# EasyEDA schematic curtains_stepper.json
TITLE: Sheet_1; REV: 1.0; Date: 2023-05-25; Sheet: 1/1; Drawn By: bowes372; Company: Your Company
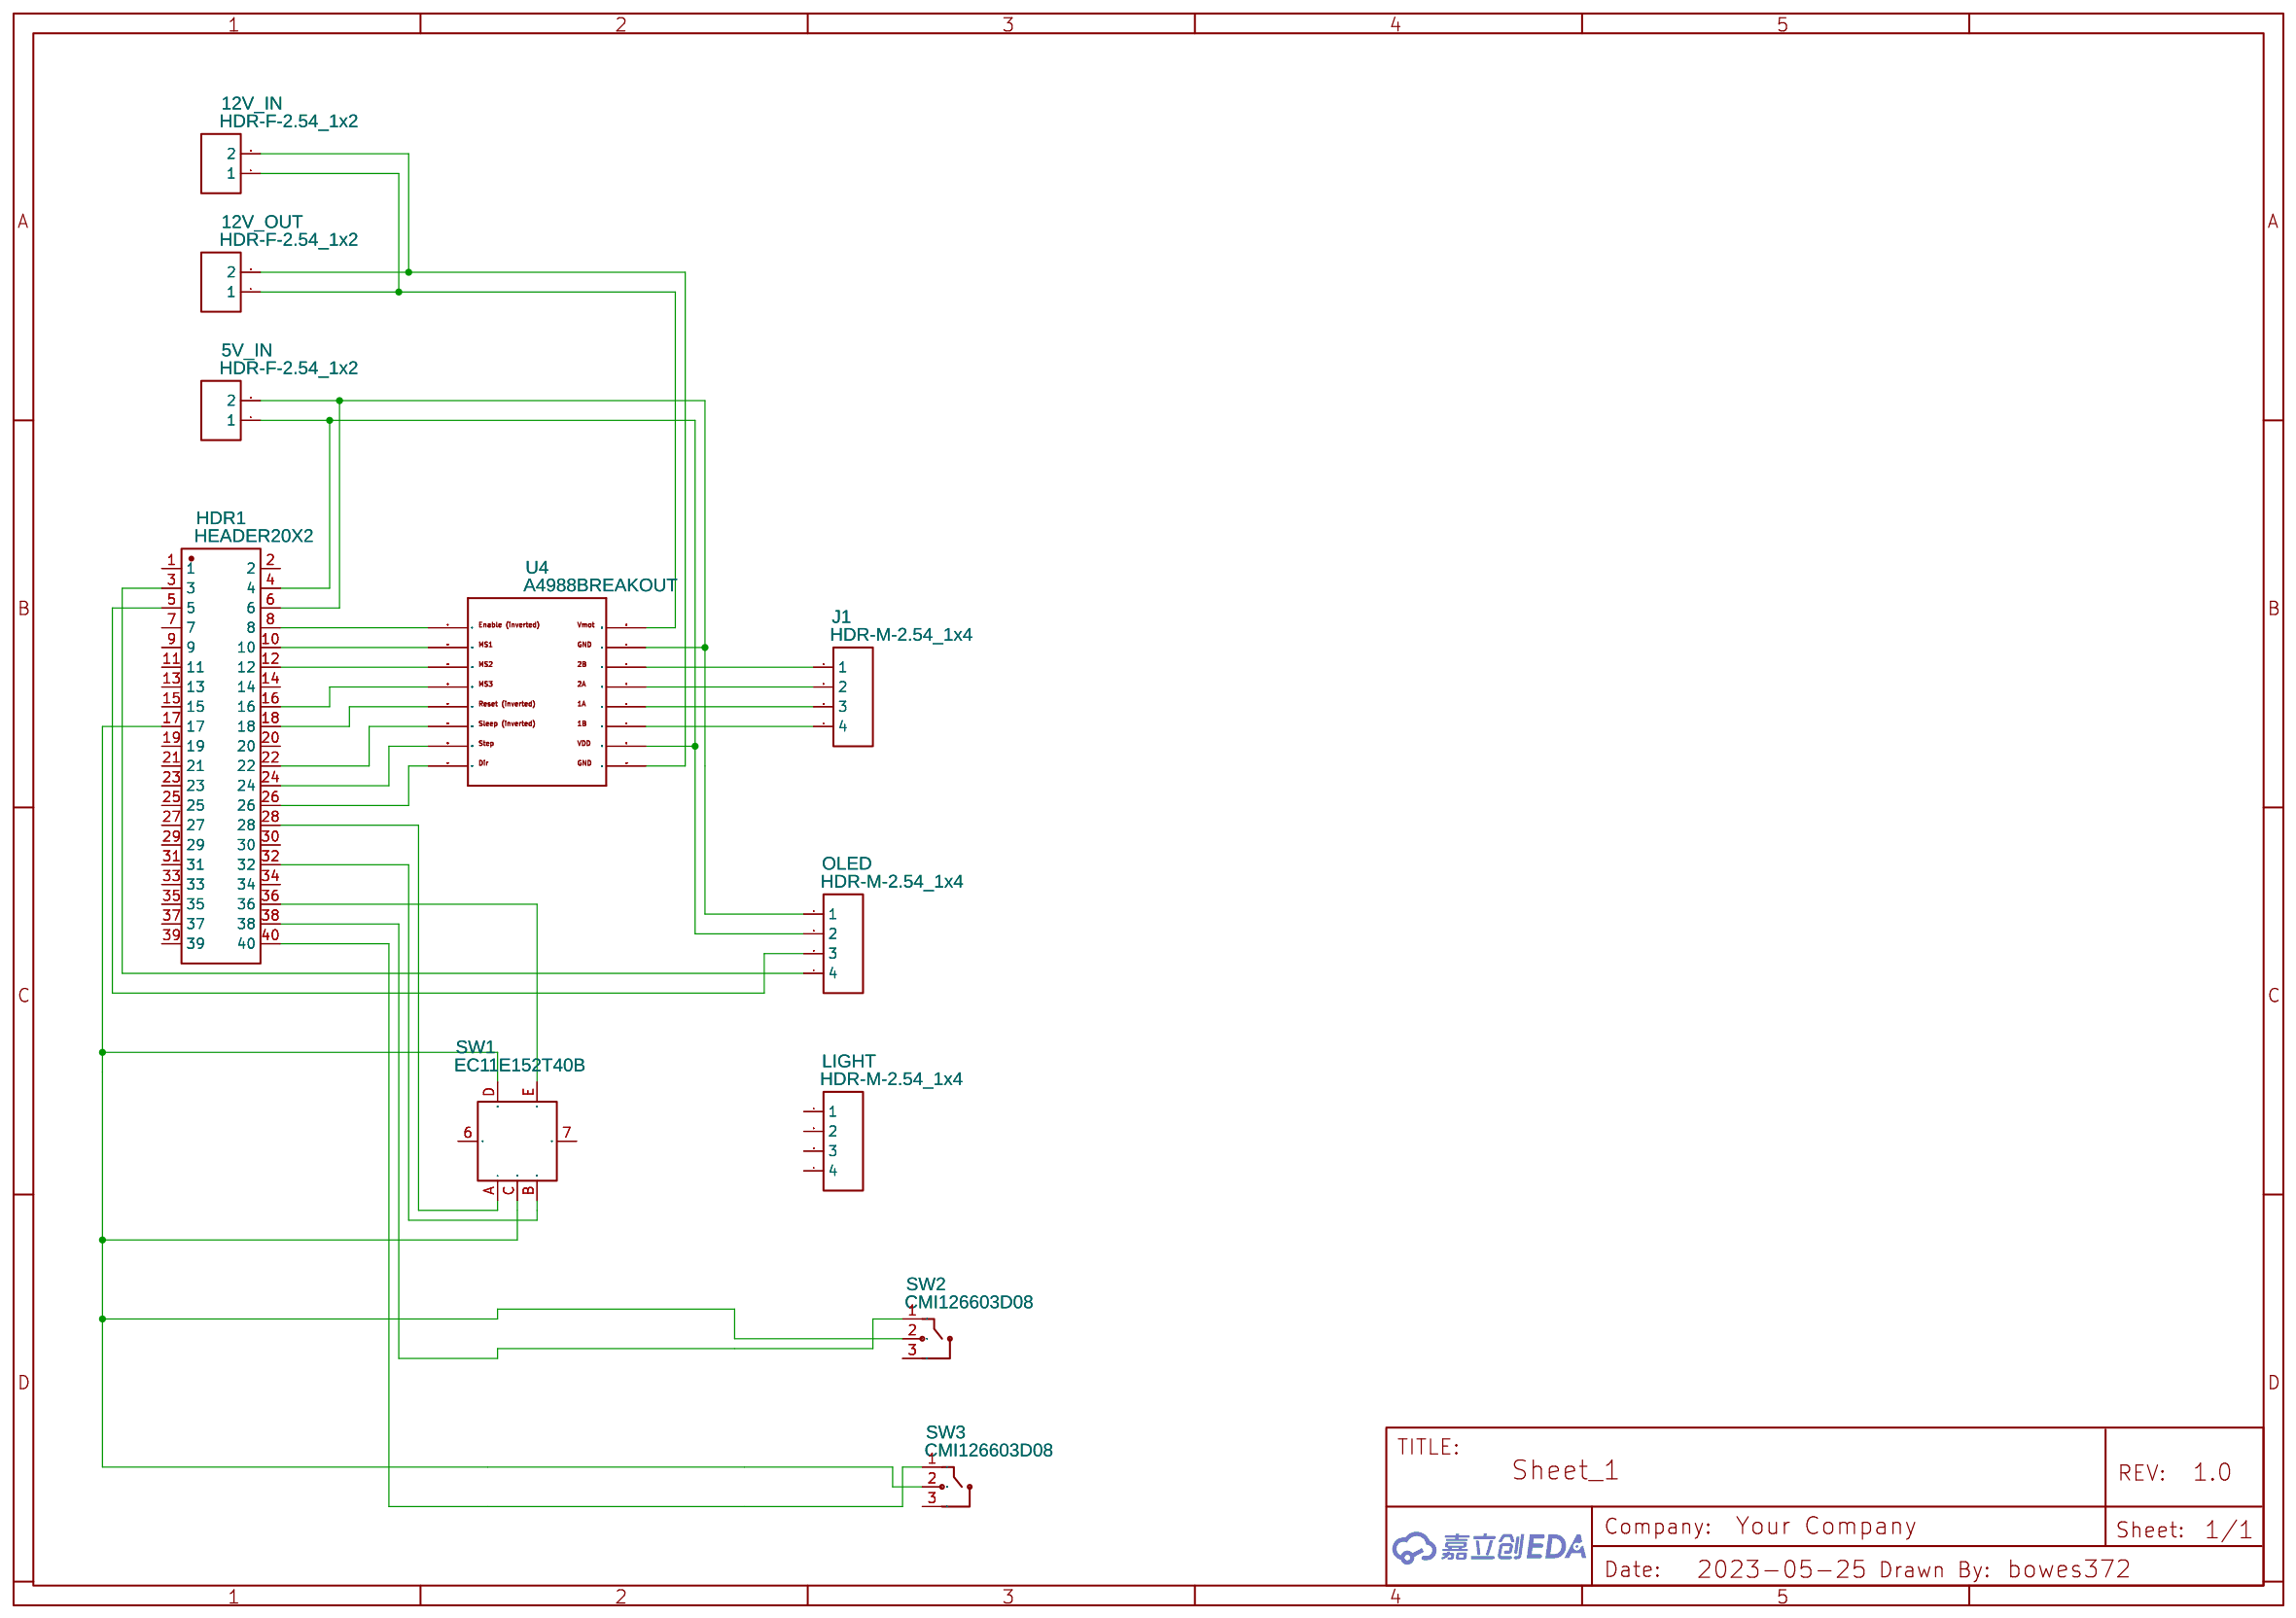
[diagram p0: schematic sheet]

## Parts
5V_IN  HDR-F-2.54_1x2  [HDR-F-2.54_1X2]
12V_IN  HDR-F-2.54_1x2  [HDR-F-2.54_1X2]
12V_OUT  HDR-F-2.54_1x2  [HDR-F-2.54_1X2]
HDR1  HEADER20X2  [HDR-TH_40P-P2.54-V-F-R2-C20-S2.54-2]
J1  HDR-M-2.54_1x4  [HDR-M-2.54_1X4]
LIGHT  HDR-M-2.54_1x4  [HDR-M-2.54_1X4]
OLED  HDR-M-2.54_1x4  [HDR-M-2.54_1X4]
SW1  EC11E152T40B  [SW-TH_EC11E152T40B]
SW2  CMI126603D08  [SW-TH_3P-L12.7-W5.6-P5.08]
SW3  CMI126603D08  [SW-TH_3P-L12.7-W5.6-P5.08]
U4  A4988BREAKOUT  [A4988BREAKOUT]

## Library data of the parts
5V_IN 12V_IN 12V_OUT = HDR-F-2.54_1x2: Supplier Part: C49661; Supplier: LCSC; Contributor: LCEDA_Lib
HDR1 = HEADER20X2: Supplier: LCSC; Supplier Part: C9900003702; Manufacturer: null; Manufacturer Part: Header20X2; Contributor: LCSC; JLCPCB Part Class: Extended Part
J1 LIGHT OLED = HDR-M-2.54_1x4: Supplier Part: C124378; Supplier: LCSC; Contributor: LCEDA_Lib
SW1 = EC11E152T40B: Supplier: LCSC; Supplier Part: C1322541; Manufacturer: ALPSALPINE; Contributor: LCSC; JLCPCB Part Class: Extended Part
SW2 SW3 = CMI126603D08: Supplier: LCSC; Supplier Part: C400256; Manufacturer: Kailh(凯华); Contributor: LCSC; JLCPCB Part Class: Extended Part
U4 = A4988BREAKOUT: Contributor: OzanC

## Nets
Net-(5V_IN-1): 5V_IN.1 HDR1.4 OLED.2 U4.VDD
Net-(5V_IN-2): 5V_IN.2 HDR1.6 OLED.1 U4.GND
Net-(12V_IN-1): 12V_IN.1 12V_OUT.1 U4.VMOT
Net-(12V_IN-2): 12V_IN.2 12V_OUT.2 U4.GND@0(GND)
Net-(HDR1-3): HDR1.3 OLED.4
Net-(HDR1-5): HDR1.5 OLED.3
Net-(HDR1-8): HDR1.8 U4.EN
Net-(HDR1-10): HDR1.10 U4.MS1
Net-(HDR1-12): HDR1.12 U4.MS2
Net-(HDR1-16): HDR1.16 U4.MS3
Net-(HDR1-17): HDR1.17 SW1.C SW1.D SW2.2 SW3.2
Net-(HDR1-18): HDR1.18 U4.RST
Net-(HDR1-22): HDR1.22 U4.SLP(SLEEP)
Net-(HDR1-24): HDR1.24 U4.STEP
Net-(HDR1-26): HDR1.26 U4.DIR
Net-(HDR1-28): HDR1.28 SW1.A
Net-(HDR1-32): HDR1.32 SW1.B
Net-(HDR1-36): HDR1.36 SW1.E
Net-(HDR1-38): HDR1.38 SW2.1
Net-(HDR1-40): HDR1.40 SW3.1
Net-(J1-1): J1.1 U4.2B
Net-(J1-2): J1.2 U4.2A
Net-(J1-3): J1.3 U4.1A
Net-(J1-4): J1.4 U4.1B

Not connected (* = marked no-connect by the designer): HDR1 1 2 7 9 11 13 14 15 19 20 21 23 25 27 29 30 31 33 34 35 37 39; LIGHT 1 2 3 4; SW1 6(EH) 7(EH); SW2 3; SW3 3
